# Altium schematic sheet STM32WLE5CBU6 dev board.SchDoc
size A3; SheetNumber: 1; SheetTotal: 3
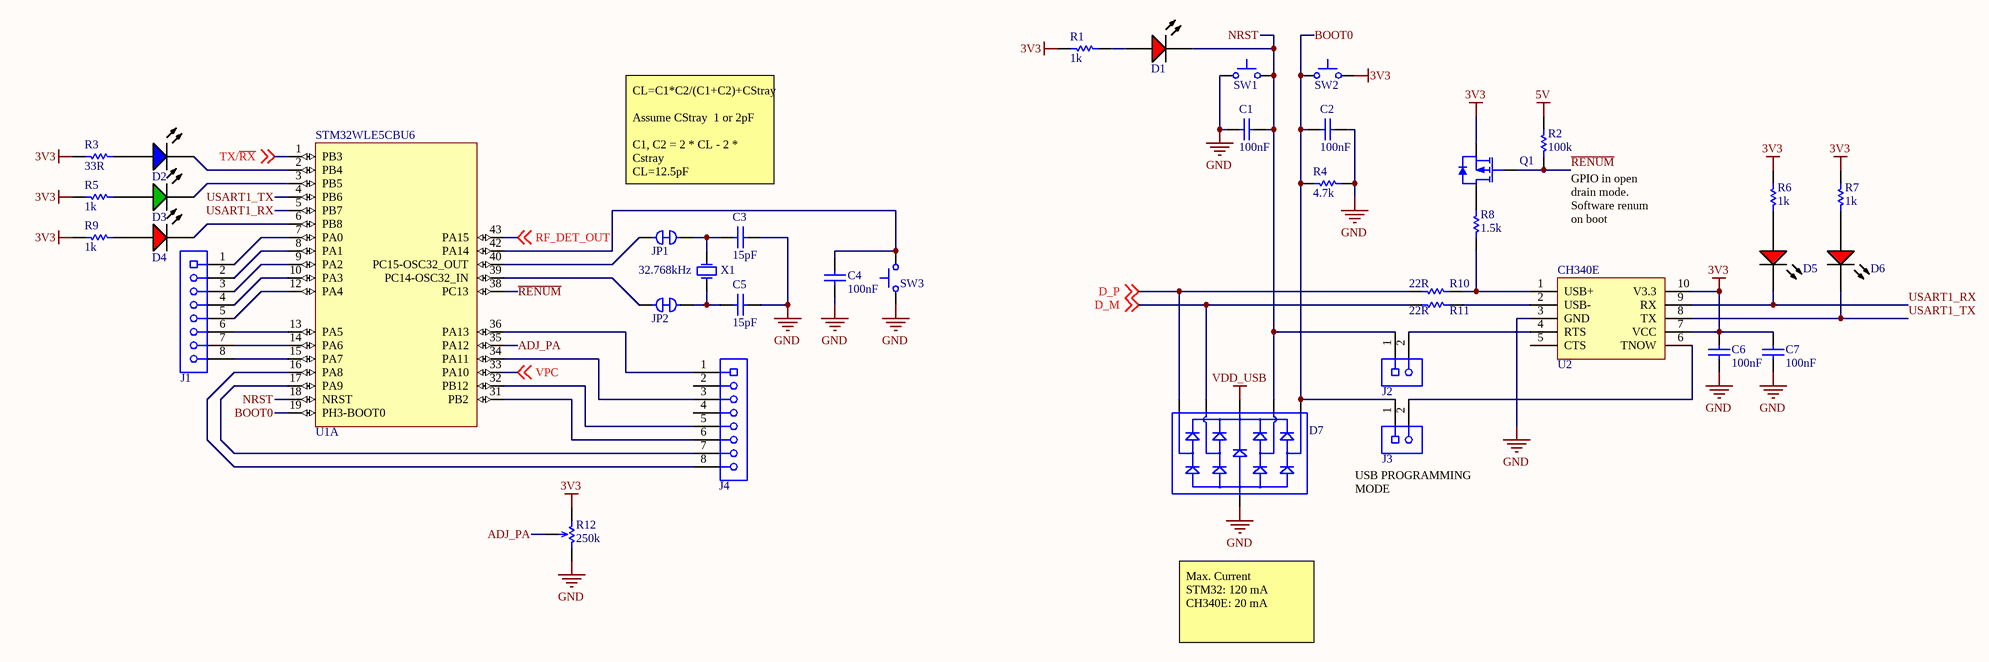
[diagram p0: STM32WLE5CBU6 dev board.SchDoc]

## Parts
C1  value 100nF  [CAPC1608X10N]  (hidden comment: C0603C104M5RACTU)
C2  value 100nF  [CAPC1608X10N]  (hidden comment: C0603C104M5RACTU)
C3  value 15pF  [CAPC1005X05N]  (hidden comment: GRM1555C1H150JA01D)
C4  value 100nF  [CAPC1608X10N]  (hidden comment: C0603C104M5RACTU)
C5  value 15pF  [CAPC1005X05N]  (hidden comment: GRM1555C1H150JA01D)
C6  value 100nF  [CAPC1608X10N]  (hidden comment: C0603C104M5RACTU)
C7  value 100nF  [CAPC1608X10N]  (hidden comment: C0603C104M5RACTU)
D1  150060RS75000  [0603_A]  (value not drawn)
D2  LTST-C191TBKT  [FP-150060GS75000-MFG]  (value not drawn)
D3  150060GS75000  [FP-150060GS75000-MFG]  (value not drawn)
D4  150060RS75000  [0603_A]  (value not drawn)
D5  150060RS75000  [0603_A]  (value not drawn)
D6  150060RS75000  [0603_A]  (value not drawn)
D7  SRV05-4-P-T7  [SOT95P280X145-6N]  (value not drawn)
J1  22-28-4080  [22-28-4080-Footprint-1]  (value not drawn)
J2  22-28-4020  [22-28-4020-Footprint-1]  (value not drawn)
J3  22-28-4020  [22-28-4020-Footprint-1]  (value not drawn)
J4  22-28-4080  [22-28-4080-Footprint-1]  (value not drawn)
JP1  RC0603FR-070RL  [RESC1608X05N]  (value not drawn)
JP2  RC0603FR-070RL  [RESC1608X05N]  (value not drawn)
Q1  SI2301CDS-T1-GE3  [SOT95P237X112-3N]  (value not drawn)
R1  value 1k  [RESC1608X05N]  (hidden comment: RC0603FR-071KL)
R2  value 100k  [RESC1608X05N]  (hidden comment: RC0603FR-07100KL)
R3  value 33R  [RESC1608X05N]  (hidden comment: CRCW060333R0FKEAC)
R4  Resistance: 4.7k  [RESC1608X05N]  (hidden comment: CRCW06034K70FKEAC)
R5  value 1k  [RESC1608X05N]  (hidden comment: RC0603FR-071KL)
R6  value 1k  [RESC1608X05N]  (hidden comment: RC0603FR-071KL)
R7  value 1k  [RESC1608X05N]  (hidden comment: RC0603FR-071KL)
R8  value 1.5k  [RESC1608X05N]  (hidden comment: RK73B1JTTD152J)
R9  value 1k  [RESC1608X05N]  (hidden comment: RC0603FR-071KL)
R10  value 22R  [RESC1005X04N]  (hidden comment: 0402WGF220JTCE)
R11  value 22R  [RESC1005X04N]  (hidden comment: 0402WGF220JTCE)
R12  value 250k  [3362P-1-502LF-Footprint-1]  (hidden comment: 3362P-1-254LF)
SW1  TL3342F160QG  [ESWI-TL3342F160QG_V]  (value not drawn)
SW2  TL3342F160QG  [ESWI-TL3342F160QG_V]  (value not drawn)
SW3  TL3342F160QG  [ESWI-TL3342F160QG_V]  (value not drawn)
U1  STM32WLE5CBU6  [QFN50P700X700X60_HS-49L]  (part A of 3)
U2  CH340E  [TSSOP50P490X110-10N]
X1  value 32.768kHz  [Q13FC1350000400-Footprint-1]  (hidden comment: Q13FC1350000400)

## Nets
3V3: C6.2 C7.2 Q1.2(S) R1.2 R3.1 R5.2 R6.2 R7.2 R9.2 R12.1(CCW) SW2.2 U2.7(VCC) U2.10(V3.3)
5V: R2.2
GND: C1.2 C2.1 C3.1 C4.2 C5.1 C6.1 C7.1 D7.2 R4.1 R12.3(CW) SW1.1 SW3.1 U2.3(GND)
VDD_USB: D7.5
ADJ_PA: R12.2(W) U1.35(PA12)
BOOT0: C2.2 D7.6 J3.1 R4.2 SW2.1 U1.19(PH3-BOOT0)
D_M: D7.3 R11.1 ; off-sheet D_M
D_P: D7.1 R10.1 ; off-sheet D_P
NRST: C1.1 D1.2(K) D7.4 J2.1 SW1.2 U1.18(NRST)
~{RENUM}: Q1.1(G) R2.1 U1.38(PC13)
RF_DET_OUT: U1.43(PA15) ; off-sheet RF_DET_OUT
TX/~{RX}: U1.1(PB3) ; off-sheet TX/~{RX}
USART1_RX: D5.2(K) U1.5(PB7) U2.9(RX)
USART1_TX: D6.2(K) U1.4(PB6) U2.8(TX)
VPC: U1.33(PA10) ; off-sheet VPC
NetC3_2: C3.2 JP1.2 X1.2(OSC2)
NetC4_1: C4.1 SW3.2 U1.42(PA14)
NetC5_2: C5.2 JP2.2 X1.1(OSC1)
NetD1_1: D1.1(A) R1.1
NetD2_1: D2.1(A) R3.2
NetD2_2: D2.2(K) U1.2(PB4)
NetD3_1: D3.1(A) R5.1
NetD3_2: D3.2(K) U1.3(PB5)
NetD4_1: D4.1(A) R9.1
NetD4_2: D4.2(K) U1.6(PB8)
NetD5_1: D5.1(A) R6.1
NetD6_1: D6.1(A) R7.1
NetJ1_1: J1.1 U1.7(PA0)
NetJ1_2: J1.2 U1.8(PA1)
NetJ1_3: J1.3 U1.9(PA2)
NetJ1_4: J1.4 U1.10(PA3)
NetJ1_5: J1.5 U1.12(PA4)
NetJ1_6: J1.6 U1.13(PA5)
NetJ1_7: J1.7 U1.14(PA6)
NetJ1_8: J1.8 U1.15(PA7)
NetJ2_2: J2.2 U2.4(RTS)
NetJ3_2: J3.2 U2.6(TNOW)
NetJ4_1: J4.1 U1.36(PA13)
NetJ4_3: J4.3 U1.34(PA11)
NetJ4_5: J4.5 U1.32(PB12)
NetJ4_6: J4.6 U1.31(PB2)
NetJ4_7: J4.7 U1.17(PA9)
NetJ4_8: J4.8 U1.16(PA8)
NetJP1_1: JP1.1 U1.40(PC15-OSC32_OUT)
NetJP2_1: JP2.1 U1.39(PC14-OSC32_IN)
NetQ1_3: Q1.3(D) R8.2
NetR8_1: R8.1 R10.2 U2.1(USB+)
NetR11_2: R11.2 U2.2(USB-)

Not connected (* = marked no-connect by the designer): J4 2 4; U2 5(CTS)

## Notes on the sheet
- CL=C1*C2/(C1+C2)+CStray
  Assume CStray  1 or 2pF
  C1, C2 = 2 * CL - 2 * Cstray
  CL=12.5pF
  C1,C215pF
- (near R2) GPIO in open drain mode.
  Software renum on boot
- USB PROGRAMMING MODE
- Max. Current
  STM32: 120 mA
  CH340E: 20 mA
- Title:
- Designer:
- Date:
- Size:
- Revision:
- A3
- Sheet:
- !
- UWA Aerospace, 35 Stirling Hwy, Perth WA 6009, Australia

## Library data of the parts
C1 C2 C4 C6 C7 = CMP-00038-5: Cap Ceramic 0.1uF 50V X7R 20% SMD 0603 125C T/R; Dissipation Factor: 2.5%; Capacitance: 100nF; Contact Plating: Tin,Matte; Length: 1.6mm; Lead Pitch: 0.7mm; Thickness: 0.034inch; Max Operating Temperature: 125°C; Voltage Rating: 50V; Termination: SMD/SMT; Depth: 0.8mm; REACH SVHC: No SVHC; Radiation Hardening: No; Case Code (Metric): 1608; Mount: Surface Mount,PCB; Package Quantity: 1; Case Code (Imperial): 0603; Width: 0.031inch; JLC_PN: C14663; Min Operating Temperature: -55°C; Packaging: Tape and Reel; Case/Package: 0603; Tolerance: 20%; Dielectric Material: Ceramic; Height: 0.8mm; Dielectric: X7R; Voltage Rating (DC): 50V
C3 C5 = CMP-00073-1: CAP CER 15PF 50V C0G/NP0 0402; Temperature Coefficient: 30ppm/°C; Material: Ceramic; Dielectric: C0G; Tolerance: 5%; Width: 0.5mm; Mount: Surface Mount; Capacitance: 15pF; Voltage: 50V; Height: 0.5mm; Packaging: Tape and Reel; Case Code (Imperial): 0402; Max Operating Temperature: 125°C; Min Operating Temperature: -55°C; Case/Package: 0402; Termination: SMD/SMT; Lead Free: Lead Free; Voltage Rating (DC): 50V; Depth: 0.5mm; REACH SVHC: No SVHC; Case Code (Metric): 1005; Thickness: 0.022inch; Length: 1mm; Radiation Hardening: No; Voltage Rating: 50V; Package Quantity: 1
D1 D4-D6 = CMP-00334-2: LED Low-Power Uni-Color Red 630nm 2V 2-Pin Chip 0603(1608Metric) T/R; Test Current: 20mA; Luminous Intensity: 250mcd; Dominant Wavelength: 625nm; Lens Style: Clear,Rectangular; Forward Current: 30mA; Viewing Angle: 140°; Width: 0.8mm; Height: 0.7mm; Color: Red; Case Code (Imperial): 0603; REACH SVHC: Unknown; Min Operating Temperature: -40°C; JLC_PN: C2286; Case/Package: 0603; Mount: Surface Mount; Forward Voltage: 2V; Max Operating Temperature: 85°C; Length: 1.6mm; Case Code (Metric): 1608; Packaging: Cut Tape; RoHS Compliant: Yes; Wavelength: 625nm; Package Quantity: 1
D2 = CMP-00176-2: LED BLUE CLEAR 0603 SMD; Power Dissipation: 76mW; Number of LEDs: 1; Viewing Angle: 130°; Forward Current: 20mA; Wavelength: 468nm; Max Power Dissipation: 75mW; Reverse Voltage: 5V; Dominant Wavelength: 475nm; Lens Style: Diffused,Colorless,Clear,Rectangular; Luminous Intensity: 180mcd; Lens Color: Colorless; Forward Voltage: 3.8V; Case Code (Metric): 1608; Color: Blue; RoHS Compliant: Yes; Min Operating Temperature: -20°C; Lens Transparency: Clear; Width: 0.8mm; Packaging: Tape and Reel; Pins: 2; Mount: Surface Mount; Max Operating Temperature: 80°C; Case Code (Imperial): 0603; Mounting Technology: Surface Mount; Height: 0.55mm; Depth: 1.6mm; Radiation Hardening: No; Lead Free: Lead Free; JLC_PN: C72041; Number of Pins: 2; Number of Elements: 1; Package Quantity: 1; Test Current: 20mA; Illumination Color: Blue; Case/Package: 0603; Length: 0.8mm
D3 = CMP-00493-2: Led, Green, 520 Nm, 3.2 V, 30 Ma, 430 Mcd Rohs Compliant: Yes; Number of LEDs: 1; Wavelength: 520nm; Lens Style: Clear,Flat,Rectangular; Test Current: 20mA; Viewing Angle: 140°; Lens Transparency: Clear; Forward Voltage: 3.2V; Luminous Intensity: 430mcd; Lens Size: 0.7mm; Forward Current: 30mA; Lens Color: Colorless; RoHS Compliant: Yes; Mounting Technology: Surface Mount; Radiation Hardening: No; Packaging: Cut Tape; Max Operating Temperature: 85°C; JLC_PN: C72043; Lead Free: Lead Free; Series: WL-SMCW; Length: 1.6mm; Min Operating Temperature: -40°C; Color: Green; Dominant Wavelength: 520nm; Mount: Surface Mount; Case/Package: 0603; Height: 0.8mm; Width: 0.8mm; Package Quantity: 1; Case Code (Metric): 1608; Case Code (Imperial): 0603; Pins: 2
D7 = CMP-00623-1: SRV05 Series 4 Ch 3.5 pF 15 Vclamp Steering Diode/TVS Array Combo - SOT-23-6 USB ESD; Peak Pulse Current: 5A; Direction: Unidirectional; Leakage Current: 5uA; Peak Pulse Power: 500W; Value: 3.5pF; Working Voltage: 5V; Clamping Voltage-Max: 15V; Number of Elements: 1; Reverse Breakdown Voltage: 6V; Test Current: 1mA; Number of Channels: 4; Depth: 1.75mm; JLC_PN: C85364; Reverse Standoff Voltage: 5V; Pins: 6; Min Operating Temperature: -55°C; Radiation Hardening: No; Lead Free: Lead Free; Packaging: Tape and Reel; RoHS Compliant: Yes; Polarity: Unidirectional; Length: 3.05mm; Max Operating Temperature: 150°C; Clamping Voltage: 15V; Case/Package: SOT-23; Mounting Technology: Surface Mount
J1 J4 = CMP-00439-1: Conn Unshrouded Header HDR 8 POS 2.54mm Solder ST Thru-Hole Bag; Number of Contacts: 8; Current Rating: 4A; Max Voltage Rating (AC): 250V; Connector Type: Male Pin; Contact Resistance: 20mR; Gender: Male; Max Voltage Rating (DC): 250.25kV; Glow Wire Compliant: Non-compliant; Contact Gender: Male; REACH SVHC: Unknown; Depth: 2.49mm; Number of Rows: 1; Lead Free: Lead Free; Max Operating Temperature: 75°C; Termination: Solder; Contact Material: Brass,Bronze; RoHS Compliant: Yes; Radiation Hardening: No; Contact Type: Male Pin; Orientation: Straight; Housing Color: Black; Number of Positions: 8; Voltage Rating: 250V; Contact Mating Length: 0.24inch; Contact Plating: Tin; Number of Circuits: 8; Min Operating Temperature: 0°C; Flammability Rating: UL94 V-0; Mount: Through Hole; Color: Black; Voltage Rating (DC): 250V; Pitch: 2.54mm; Package Quantity: 1; Housing Material: Thermoplastic; Packaging: Bulk; Series: 42375
J2 J3 = CMP-00157-4: KK 254 Breakaway Header, Vertical, 2 Circuits, Tin (Sn) Plating, Mating Pin Length 6.09mm 2 POS; Number of Positions: 2; Connector Type: Male Pin; Max Voltage Rating (AC): 250V; Current Rating: 4A; Pitch: 2.54mm; Contact Resistance: 20mR; Gender: Male; Glow Wire Compliant: Non-compliant; Mounting Technology: Through Hole; Color: Black; Contact Mating Length: 0.24inch; Depth: 2.49mm; Termination: Solder; Max Operating Temperature: 75°C; Package Quantity: 1; Number of Rows: 1; Flammability Rating: UL94 V-0; Contact Plating: Tin; Contact Material: Brass,Bronze; Voltage Rating (DC): 250V; Max Voltage Rating (DC): 250V; Mount: Through Hole; Min Operating Temperature: 0°C; Housing Color: Black; Series: KK® 42375; Housing Material: Nylon; Radiation Hardening: No; Number of Circuits: 2; Voltage Rating: 250V; Packaging: Bulk; Number of Contacts: 2; Contact Type: Male Pin; REACH SVHC: Unknown; Lead Free: Lead Free; Orientation: Straight
JP1 JP2 = CMP-00415-4: RC Series 0603 0.1 W 0 Ohm Jumper Surface Mount Thick Film Chip Resistor; Voltage Rating: 50V; Temperature Coefficient: 200ppm/°C; Max Power Dissipation: 100mW; Tolerance: 1%; Resistance: 0mR; Working Voltage: 75V; Current Rating: 1A; Radiation Hardening: No; Case Code (Metric): 1608; Military Standard: Not; Max Operating Temperature: 155°C; Power Rating: 100mW; Features: Moisture Resistant; Length: 1.6mm; RoHS Compliant: Yes; Series: RC; Termination: SMD/SMT; Package Quantity: 5000; REACH SVHC: No SVHC; Contact Plating: Tin,Matte; Height: 0.45mm; Resistor Type: Thick Film; Construction: Rectangular; Case Code (Imperial): 0603; Case/Package: 0603; JLC_PN: C21189; Technology: THICK FILM; Packaging: Tape and Reel; Voltage Rating (DC): 50V; Depth: 0.8mm; Number of Terminations: 2; Lead Free: Lead Free; Resistance Tolerance: 1%; Number of Pins: 2; Width: 0.8mm; Min Operating Temperature: -55°C
Q1 = CMP-00628-1: Trans Mosfet P-ch 20V 3.1A 3-PIN SOT-23 T/r / Mosfet P-ch 20V 3.1A SOT23-3; Turn-Off Delay Time: 30ns; Max Power Dissipation: 1.6W; Drain to Source Voltage (Vdss): -20V; Power Dissipation: 860mW; Number of Elements: 1; Input Capacitance: 405pF; Polarity: P-CHANNEL; Drain-source On Resistance-Max: 112mR; Continuous Drain Current (ID): 2.3A; Fall Time: 35ns; Nominal Vgs: -400mV; Turn-On Delay Time: 11ns; Gate to Source Voltage (Vgs): 8V; Width: 1.4mm; Series: TrenchFET®; Pins: 3; Min Operating Temperature: -55°C; Package Quantity: 3000; Packaging: Tape and Reel; Rise Time: 35ns; Weight: 0.050717oz; JLC_PN: C10487; Max Operating Temperature: 150°C; Rds On Max: 112mR; Threshold Voltage: -400mV; RoHS Compliant: Yes; Mounting Technology: Surface Mount; Drain to Source Resistance: 112mR; Case/Package: SOT-23; Number of Channels: 1; Reach SVHC Compliant: Unknown; Radiation Hardening: No; Length: 3.04mm; Lead Free: Lead Free; Height: 1.02mm
R1 R5-R7 R9 = CMP-00167-4: Res Thick Film 0603 1K Ohm 1% 1/10W ±100ppm/°C Molded SMD SMD Paper T/R; Resistance: 1kR; Power Rating: 100mW; Voltage Rating: 50V; JLC_PN: C21190; Military Standard: Not; Construction: Rectangular; Features: Moisture Resistant; Case Code (Imperial): 0603; Temperature Coefficient: 100ppm/°C; RoHS Compliant: Yes; Series: RC; Max Operating Temperature: 155°C; Size Code: 0603; Length: 1.6mm; Contact Plating: Tin,Matte; Radiation Hardening: No; Case Code (Metric): 1608; REACH SVHC: No SVHC; Depth: 0.8mm; Termination: SMD/SMT; Packaging: Tape and Reel; Min Operating Temperature: -55°C; Case/Package: 0603; Tolerance: 1%; Height: 0.45mm; Resistor Type: Thick Film; Resistance Tolerance: 1%; Max Power Dissipation: 100mW; Technology: THICK FILM; Lead Free: Lead Free; Number of Terminations: 2
R2 = CMP-00345-2: RES SMD 100K OHM 1% 1/10W 0603; Max Power Dissipation: 100mW; Resistance: 100kR; Voltage Rating (DC): 50V; Temperature Coefficient: 100ppm/°C; Working Voltage: 75V; Termination: SMD/SMT; Case Code (Metric): 1608; Height: 0.45mm; Reach SVHC Compliant: No; JLC_PN: C25803; Case Code (Imperial): 0603; Case/Package: 0603; Power Rating: 100mW; Lead Free: Lead Free; Voltage Rating: 50V; Min Operating Temperature: -55°C; Width: 0.8mm; Technology: THICK FILM; Tolerance: 1%; Max Operating Temperature: 155°C; Number of Pins: 2; Pins: 2; Features: Moisture Resistant; Number of Terminations: 2; Construction: Rectangular; Series: RC; Military Standard: Not; Resistor Type: Thick Film; Resistance Tolerance: 1%; REACH SVHC: No SVHC; Depth: 0.8mm; Packaging: Tape and Reel; RoHS Compliant: Yes; Length: 1.6mm
R3 = CMP-00602-2: Res Thick Film 0603 33 Ohm 1% 1/10W ±100ppm/°C Molded SMD Paper T/R; Max Power Dissipation: 100mW; Voltage Rating (DC): 75V; Ratings: AEC-Q200; Series: CRCW; Temperature Coefficient: 100ppm/°C; Packaging: Tape and Reel; Tolerance: 1%; Mounting Technology: Surface Mount; Depth: 0.85mm; Case Code (Imperial): 0603; Length: 1.55mm; Contact Plating: Tin; Case/Package: Molded; Width: 0.033inch; Package Quantity: 10; Max Operating Temperature: 155°C; Lead Free: Lead Free; Radiation Hardening: No; Power Rating: 100mW; Height: 0.45mm; Termination: Wraparound; Military Standard: Not; Construction: Rectangular; Min Operating Temperature: -55°C; Technology: THICK FILM; Resistance Tolerance: 1%; JLC_PN: C23140; Number of Terminations: 2; Weight: 7.1E-05oz; Features: Automotive AEC-Q200; Resistor Type: Thick Film; Voltage Rating: 75V; Case Code (Metric): 1608
R4 = CMP-009-000009-3: 4.7kO 1% 0603 thick film; Value: 4.7kR; Max Power Dissipation: 100mW; Temperature Coefficient: 100ppm/°C; Voltage Rating (DC): 75V; Series: CRCW; Ratings: AEC-Q200; JLC_PN: C23162; Number of Terminations: 2; Max Operating Temperature: 155°C; Contact Plating: Tin; Features: Automotive AEC-Q200; Packaging: Cut Tape; Resistor Type: Thick Film; Case Code (Metric): 1608; Height: 0.45mm; Component Type: Standard; Width: 0.85mm; Source: BMS_LIB.SchLib; Min Operating Temperature: -55°C; Length: 1.55mm; Weight: 7.1E-05oz; Power Rating: 100mW; Case/Package: 0603; Package Quantity: 5000; Depth: 0.85mm; Military Standard: Not; Voltage Rating: 75V; Tolerance: 1%; Lead Free: Lead Free; Mounting Technology: Surface Mount; Case Code (Imperial): 0603; Design Item ID: CRCW06034K70FKEAC; Technology: THICK FILM; Termination: SMD/SMT; Pin Count: 2
R8 = CMP-00553-3: Res Thick Film 0603 1.5K Ohm 5% 0.1W(1/10W) ±200ppm/C Pad SMD Automotive T/R; Temperature Coefficient: 200ppm/°C; Voltage Rating (DC): 50V; Power Rating: 100mW; Lead Free: Lead Free; Case/Package: 0603; Technology: THICK FILM; Mounting Technology: Surface Mount; Width: 0.8mm; Height: 0.45mm; Reach SVHC Compliant: Yes; Construction: Rectangular; Series: RK73B; Resistance Tolerance: 5%; Case Code (Metric): 1608; Max Operating Temperature: 155°C; Resistor Type: Thick Film; JLC_PN: C22843; Min Operating Temperature: -55°C; Pins: 2; Case Code (Imperial): 0603; Tolerance: 5%; Termination: SMD/SMT; Length: 1.6mm; Packaging: Tape and Reel; Depth: 0.8mm; Package Quantity: 5000; Voltage Rating: 50V; Military Standard: Not
R10 R11 = CMP-00625-1: 22R 1/16W %1 0402; Temperature Coefficient: ±200ppm/℃; Tolerance: ±1%; Power(Watts): 62.5mW; Overload Voltage (Max): 50V; Operating Temperature Range: -55℃~+155℃; Resistance: 22R; Type: Thick Film Resistors
R12 = CMP-00218-1: Bourns 3362P-1-254LF THT Trimpot, 250k, 10%, 1 Turn; Temperature Coefficient: 100ppm/°C; Number of Turns: 1; Power Rating: 500mW; Resistance: 250kR; Resistor Type: Cermet; Technology: CERMET; Tolerance: 10%; Termination: Pin; Series: Trimpot® 3362 - Sealed; Radiation Hardening: No; Packaging: Rail/Tube; Max Operating Temperature: 125°C; RoHS Compliant: Yes; Resistance Tolerance: 10%; Max Power Dissipation: 500mW; REACH SVHC: No SVHC; Taper: Linear; Military Standard: Not; Width: 6.6mm; Min Operating Temperature: -55°C; Weight: 0.02oz; Length: 6.6mm; Depth: 6.99mm; Height: 0.185inch; Package Quantity: 250; Mount: Through Hole
SW1-SW3 = CMP-00387-4: Switch Tactile N.O. SPST Round Button Gull Wing 0.05A 12VDC 100000Cycles 1.57N SMD T/R; pin to pad: 1>1+2 2>3+4; Max Voltage Rating (DC): 12V; Operating Force: 160gf; Illumination Type: Non-Illuminated; Actuator Material: Polyphenylene; Current Rating: 50mA; Switch Function: Off-Mom; Actuator Length: 0.3mm; Actuator Type: Standard; Throw Configuration: SPST; Package Quantity: 3000; Contact Material: Silver; Electrical Life: 100000Cycles; Voltage Rating (DC): 12V; Mount: Surface Mount; Termination: Gull Wing; Contact Plating: Silver; RoHS Compliant: Yes; Orientation: Straight; Packaging: Tape and Reel; Mechanical Life: 100000Cycles; Size: 5.2mm; Series: TL3342
U1 = CMP-00608-3: Microcontroller 32-Bit Arm Cortex-M4 RISC 128Kbyte 1.8V to 3.6V 48-Pin UFQFPN Industrial; Core:: ARM Cortex M4; Number of I/Os:: 43 I/O; Tradename:: STM32; Program Memory Size:: 128 kB; ADC Resolution:: 12 bit; Data Bus Width:: 32 bit; Package / Case:: UFQFPN-48; Product Category:: RF Microcontrollers - MCU; Mounting Style:: SMD/SMT; Brand:: STMicroelectronics; Interface Type:: I2C; Packaging:: Tray; Subcategory:: Wireless & RF Integrated Circuits; Data RAM Type:: RAM; Technology:: Si; Data RAM Size:: 64 kB; Maximum Clock Frequency:: 48 MHz; Program Memory Type:: Flash; Supply Voltage - Max:: 3.6 V; Series:: STM32WL; Minimum Operating Temperature:: - 40 C; Operating Supply Voltage:: 1.8 V to 3.6 V; Product Type:: RF Microcontrollers - MCU; Maximum Operating Temperature:: + 105 C; Supply Voltage - Min:: 1.8 V; Manufacturer:: STMicroelectronics; Moisture Sensitive:: Yes
U2 = CMP-00174-3: Transceiver 2Mbps USB 2.0 MSOP-10 USB ICs ROHS; ComponentLink1Description: datasheet; JLC_PN: C99652; ComponentLink1URL: https://www.mpja.com/download/35227cpdata.pdf
X1 = CMP-00624-1: Crystal 0.032768MHz ±20ppm (Tol) 12.5pF FUND 70000Ohm 2-Pin CSMD T/R 32.768 kHz; ESR (Equivalent Series Resistance): 70kR; RoHS Compliant: Yes; Min Operating Temperature: -40°C; Max Operating Temperature: 85°C; Case/Package: SMD/SMT; Load Capacitance: 12.5pF; Mounting Technology: Surface Mount; JLC_PN: C32346; Series: FC-135; Frequency: 32.768kHz; Packaging: Cut Tape; Frequency Tolerance: 20ppm